# EAGLE schematic Calunium_v2_smd_1 (EAGLE 6.4)
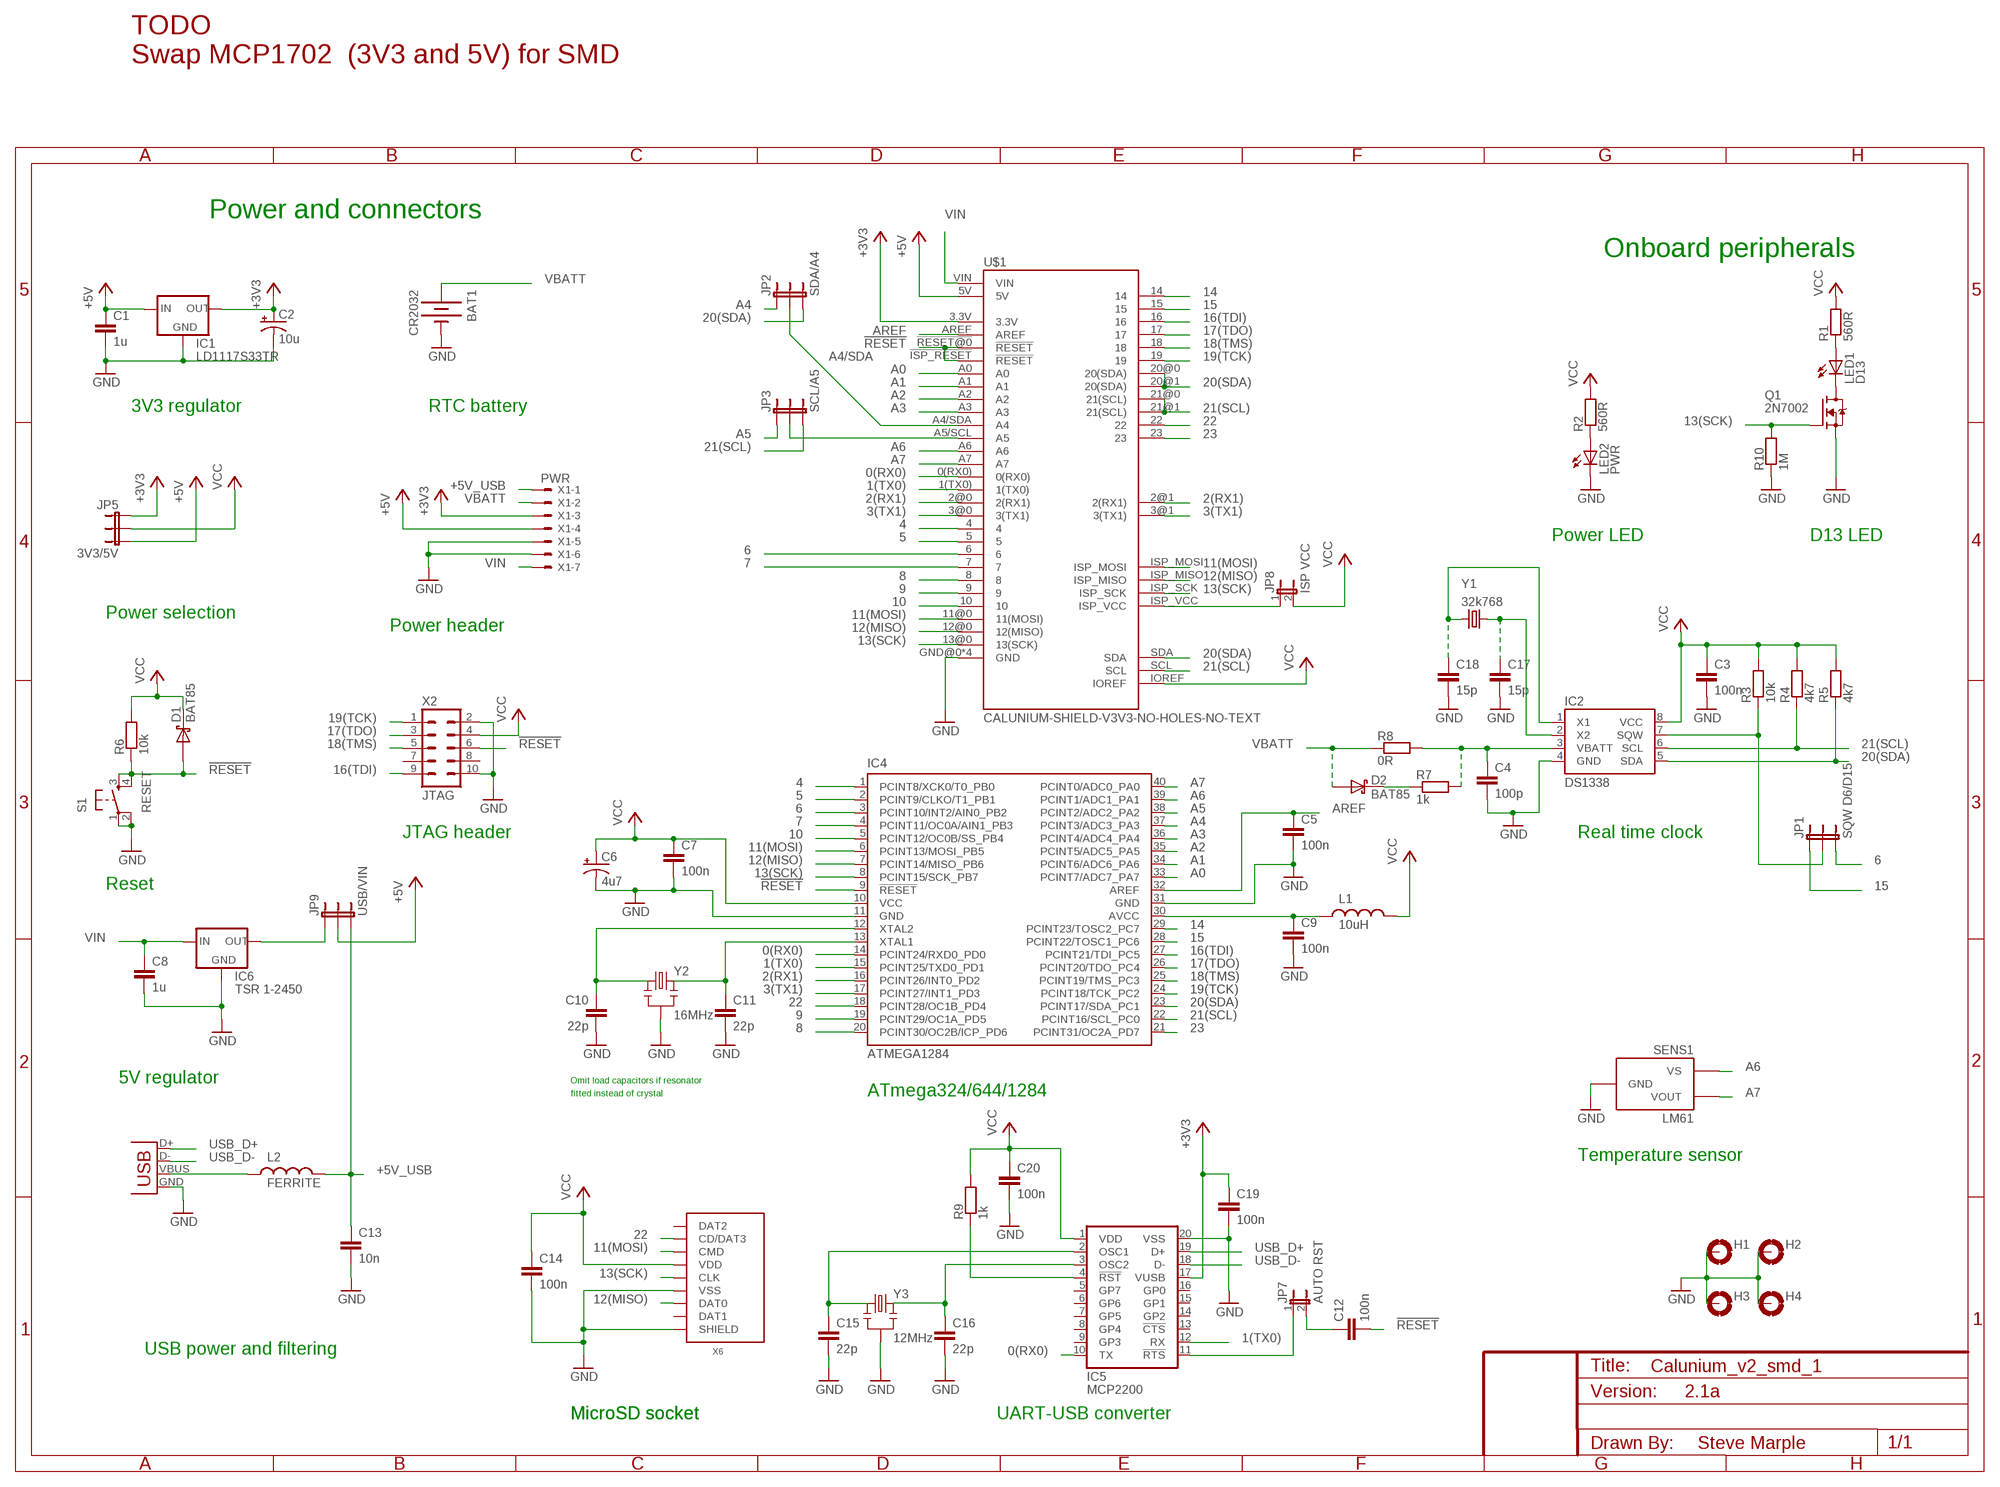
[diagram p0: schematic, sheet 1]

## Parts
BAT1  CR2032  BATTERY20PTH  [BATTCOM_20MM_PTH]
C1  1u  C-EU1206-HAND  [1206-HAND]
C2  10u  CAP_POLPTH2  [CPOL-RADIAL-10UF-25V]
C3  100n  C-EU1206-HAND  [1206-HAND]
C4  100p  C-EU1206-HAND  [1206-HAND]
C5  100n  C-EU1206-HAND  [1206-HAND]
C6  4u7  CAP_POLPTH2  [CPOL-RADIAL-10UF-25V]
C7  100n  C-EU1206-HAND  [1206-HAND]
C8  1u  C-EU1206-HAND  [1206-HAND]
C9  100n  C-EU1206-HAND  [1206-HAND]
C10  22p  C-EU0805-HAND  [0805-HAND]
C11  22p  C-EU0805-HAND  [0805-HAND]
C12  100n  C-EU1206-HAND  [1206-HAND]
C13  10n  C-EU1206-HAND  [1206-HAND]
C14  100n  C-EU1206-HAND  [1206-HAND]
C15  22p  C-EU0805-HAND  [0805-HAND]
C16  22p  C-EU0805-HAND  [0805-HAND]
C17  15p  C-EU0805-HAND  [0805-HAND]
C18  15p  C-EU0805-HAND  [0805-HAND]
C19  100n  C-EU1206-HAND  [1206-HAND]
C20  100n  C-EU1206-HAND  [1206-HAND]
D1  BAT85  DIODE-SCHOTTKYSOT23-1-3-HAND  [SOT23-3-HAND]
D2  BAT85  DIODE-SCHOTTKYSOT23-1-3-HAND  [SOT23-3-HAND]
H1  MOUNT-PAD-ROUND3.0  [3,0-PAD]
H2  MOUNT-PAD-ROUND3.0  [3,0-PAD]
H3  MOUNT-PAD-ROUND3.0  [3,0-PAD]
H4  MOUNT-PAD-ROUND3.0  [3,0-PAD]
IC1  LD1117S33TR  V_REG_LD1117VXXSOT223-HAND  [SOT223-HAND]
IC2  DS1338  DS1307SO08  [SO08]
IC4  ATMEGA1284  ATMEGA644-20PU  [DIL40]
IC5  MCP2200  [SO20]
IC6  TSR 1-2450  V_REG_78XXTSR-1-XXXX  [TSR-1-XXXX]
JP1  SQW D6/D15  JUMPER-3PTH  [1X03]
JP2  SDA/A4  JUMPER-3PTH  [1X03]
JP3  SCL/A5  JUMPER-3PTH  [1X03]
JP5  3V3/5V  JUMPER-3PTH  [1X03]
JP7  AUTO RST  JUMPER-2PTH  [1X02]
JP8  ISP VCC  JUMPER-2PTH  [1X02]
JP9  USB/VIN  JUMPER-3PTH  [1X03]
L1  10uH  INDUCTOR1210-HAND  [1210-HAND]
L2  FERRITE  INDUCTOR0805-HAND  [0805-HAND]
LED1  D13  LED3MM  [LED3MM]
LED2  PWR  LED3MM  [LED3MM]
Q1  2N7002  [SOT23-3-ROTATED]
R1  560R  RESISTOR1206-HAND  [1206-HAND]
R2  560R  RESISTOR1206-HAND  [1206-HAND]
R3  10k  RESISTOR1206-HAND  [1206-HAND]
R4  4k7  RESISTOR1206-HAND  [1206-HAND]
R5  4k7  RESISTOR1206-HAND  [1206-HAND]
R6  10k  RESISTOR1206-HAND  [1206-HAND]
R7  1k  RESISTOR1206-HAND  [1206-HAND]
R8  0R  RESISTOR1206-HAND  [1206-HAND]
R9  1k  RESISTOR1206-HAND  [1206-HAND]
R10  1M  RESISTOR1206-HAND  [1206-HAND]
S1  RESET  TAC_SWITCHPTH  [TACTILE-PTH]
SENS1  LM61  [TO-92]
U$1  CALUNIUM-SHIELD-V3V3-NO-HOLES-NO-TEXT  [CALUNIUM-SHIELD-NO-OUTLINE-NO-HOLES-NO-TEXT-V3]
X1  PWR  22-23-2071  [22-23-2071]
X2  JTAG  ATMEL-JTAG  [CON-HARTING-ML10]
X3  USB  USBPTH  [USB-B-PTH]
X6  MICRO-SD-SOCKETHIROSE-DM3D  [MICRO-SD-SOCKET-HIROSE-DM3D]
Y1  32k768  CRYSTALTC38H  [TC38H]
Y2  16MHz  CRYSTAL-RESONATOR  [HC49U-V-RESONATOR]
Y3  12MHz  CRYSTAL-RESONATOR  [HC49U-V-RESONATOR]

## Nets
0(RX0): IC4.14(PCINT24/RXD0_PD0) IC5.10(TX) U$1.0(RX0)
1(TX0): IC4.15(PCINT25/TXD0_PD1) IC5.12(RX) U$1.1(TX0)
2(RX1): IC4.16(PCINT26/INT0_PD2) U$1.2@0(2(RX1)) U$1.2@1(2(RX1))
3(TX1): IC4.17(PCINT27/INT1_PD3) U$1.3@0(3(TX1)) U$1.3@1(3(TX1))
4: IC4.1(PCINT8/XCK0/T0_PB0) U$1.4
5: IC4.2(PCINT9/CLKO/T1_PB1) U$1.5
6: IC4.3(PCINT10/INT2/AIN0_PB2) JP1.3 U$1.6
7: IC4.4(PCINT11/OC0A/AIN1_PB3) U$1.7
8: IC4.20(PCINT30/OC2B/ICP_PD6) U$1.8
9: IC4.19(PCINT29/OC1A_PD5) U$1.9
10: IC4.5(PCINT12/OC0B/SS_PB4) U$1.10
11(MOSI): IC4.6(PCINT13/MOSI_PB5) U$1.11@0(11(MOSI)) U$1.ISP_MOSI X6.CMD
12(MISO): IC4.7(PCINT14/MISO_PB6) U$1.12@0(12(MISO)) U$1.ISP_MISO X6.DAT0
13(SCK): IC4.8(PCINT15/SCK_PB7) Q1.1(G) R10.2 U$1.13@0(13(SCK)) U$1.ISP_SCK X6.CLK
14: IC4.29(PCINT23/TOSC2_PC7) U$1.14
15: IC4.28(PCINT22/TOSC1_PC6) JP1.1 U$1.15
16(TDI): IC4.27(PCINT21/TDI_PC5) U$1.16 X2.9(TDI)
17(TDO): IC4.26(PCINT20/TDO_PC4) U$1.17 X2.3(TDO)
18(TMS): IC4.25(PCINT19/TMS_PC3) U$1.18 X2.5(TMS)
19(TCK): IC4.24(PCINT18/TCK_PC2) U$1.19 X2.1(TCK)
20(SDA): IC2.5(SDA) IC4.23(PCINT17/SDA_PC1) JP2.3 R5.1 U$1.20@0(20(SDA)) U$1.20@1(20(SDA)) U$1.SDA
21(SCL): IC2.6(SCL) IC4.22(PCINT16/SCL_PC0) JP3.3 R4.1 U$1.21@0(21(SCL)) U$1.21@1(21(SCL)) U$1.SCL
22: IC4.18(PCINT28/OC1B_PD4) U$1.22 X6.CD/DAT3
23: IC4.21(PCINT31/OC2A_PD7) U$1.23
!MCP2200_RESET: IC5.4(!RST) R9.1
!RESET: C12.2 D1.1(A) IC4.9(!RESET) R6.1 S1.3 S1.4 U$1.!ISP_RESET(!RESET) U$1.!RESET@0(!RESET) X2.6(!SRST)
+3V3 [power]: C2.1(+) C19.1 IC1.2(OUT) IC1.4(OUT) IC5.17(VUSB) JP5.1 U$1.3.3V X1.3
+5V [power]: C1.1 IC1.3(IN) JP5.3 JP9.2 U$1.5V X1.4
+5V_USB [power]: C13.1 JP9.3 L2.2 X1.1
A0: IC4.33(PCINT7/ADC7_PA7) U$1.A0
A1: IC4.34(PCINT6/ADC6_PA6) U$1.A1
A2: IC4.35(PCINT5/ADC5_PA5) U$1.A2
A3: IC4.36(PCINT4/ADC4_PA4) U$1.A3
A4: IC4.37(PCINT3/ADC3_PA3) JP2.1
A4/SDA: JP2.2 U$1.A4/SDA(A4)
A5: IC4.38(PCINT2/ADC2_PA2) JP3.1
A5/SCL: JP3.2 U$1.A5/SCL(A5)
A6: IC4.39(PCINT1/ADC1_PA1) SENS1.1(VS) U$1.A6
A7: IC4.40(PCINT0/ADC0_PA0) SENS1.2(VOUT) U$1.A7
AREF: C5.1 IC4.32(AREF) U$1.AREF
AUTO_RESET: IC5.11(!RTS) JP7.1
AVCC [power]: C9.1 IC4.30(AVCC) L1.1
GND [power]: BAT1.2(-) C1.2 C2.2(-) C3.2 C4.2 C5.2 C6.2(-) C7.2 C8.2 C9.2 C10.2 C11.2 C13.2 C14.2 C15.2 C16.2 C17.2 C18.2 C19.2 C20.2 H1.B3,0(MOUNT) H2.B3,0(MOUNT) H3.B3,0(MOUNT) H4.B3,0(MOUNT) IC1.1(GND) IC2.4(GND) IC4.11(GND) IC4.31(GND) IC5.20(VSS) IC6.GND LED2.K(C) Q1.2(S) R10.1 S1.1 S1.2 SENS1.3(GND) U$1.GND@0(GND) U$1.GND@1(GND) U$1.GND@2(GND) U$1.GND@3(GND) X1.5 X1.6 X2.2(GND) X2.10(GND) X3.GND X6.GND(VSS) X6.SHIELD@0(SHIELD) Y2.GND Y3.GND
N$1: C11.1 IC4.13(XTAL1) Y2.2
N$2: C10.1 IC4.12(XTAL2) Y2.1
N$3: LED1.A R1.1
N$4: LED1.K(C) Q1.3(D)
N$5: C18.1 IC2.1(X1) Y1.2
N$6 [power]: JP8.1 U$1.ISP_VCC
N$7: C16.1 IC5.3(OSC2) Y3.2
N$8: LED2.A R2.1
N$9: D2.3(C) R7.1
N$11: C4.1 IC2.3(VBATT) R7.2 R8.2
N$12: C17.1 IC2.2(X2) Y1.1
N$14: IC6.OUT JP9.1
N$15: C12.1 JP7.2
N$16 [power]: L2.1 X3.VBUS
N$18: C15.1 IC5.2(OSC1) Y3.1
SQW: IC2.7(SQW) JP1.2 R3.1
USB_D+: IC5.19(D+) X3.D+
USB_D-: IC5.18(D-) X3.D-
VBATT: BAT1.1(+) D2.1(A) R8.1 X1.2
VCC [power]: C3.1 C6.1(+) C7.1 C14.1 C20.1 D1.3(C) IC2.8(VCC) IC4.10(VCC) IC5.1(VDD) JP5.2 JP8.2 L1.2 R1.2 R2.2 R3.2 R4.2 R5.2 R6.2 R9.2 U$1.IOREF X2.4(VTREF) X6.VDD
VIN [power]: C8.1 IC6.IN U$1.VIN X1.7
Unconnected: IC5.5(GP7) IC5.6(GP6) IC5.7(GP5) IC5.8(GP4) IC5.9(GP3) IC5.13(!CTS) IC5.14(GP2) IC5.15(GP1) IC5.16(GP0) X2.7(NC) X2.8(NC) X6.DAT1 X6.DAT2

## Notes on the sheet
- TODO
  Swap MCP1702  (3V3 and 5V) for SMD
- Power and connectors
- Onboard peripherals
- 3V3 regulator | RTC battery
- Power LED | D13 LED
- Power selection
- Power header
- JTAG header | Real time clock
- Reset
- 5V regulator | Omit load capacitors if resonator
- fitted instead of crystal | ATmega324/644/1284
- Temperature sensor
- USB power and filtering
- 2.1a
- MicroSD socket | MicroSD socket | UART-USB converter
- Steve Marple

## Library data of the parts
BAT1 = SparkFun:BATTERY: Battery Holders Various common sizes : AA, AAA, 20mm coin cell and 12mm coin cell.
C1 C3-C5 C7-C9 C12-C20 = SteveMarple:C-EU
C2 = SteveMarple:CAP_POL: Capacitor Polarized These are standard SMD and PTH capacitors. Normally 10uF, 47uF, and 100uF in electrolytic and tantalum varieties. Always verify the external diameter of the through hole cap, it varies with capacity, voltage, and manufacturer. The EIA devices should be standard.
C6 = SparkFun:CAP_POL: Capacitor Polarized These are standard SMD and PTH capacitors. Normally 10uF, 47uF, and 100uF in electrolytic and tantalum varieties. Always verify the external diameter of the through hole cap, it varies with capacity, voltage, and manufacturer. The EIA devices should be standard.
C10 C11 = SteveMarple:C-EU; OPTION: Do not fit for ceramic resonator
D1 D2 = SteveMarple:DIODE-SCHOTTKY
H1-H4 = holes:MOUNT-PAD-ROUND: MOUNTING PAD, round
IC1 = SteveMarple:V_REG_LD1117VXX: CHECK PINOUT!!!!!!!!!!!!!!!!!!! LD1117VXX voltage regulator. We carry the 3.3V version (COM-00526) in TO-220 package.
IC2 = SteveMarple:DS1307
IC4 = SteveMarple:ATMEGA644-*PU: 8-bit Microcontroller with 64K Bytes In-System Programmable Flash Auto generated by make-symbol-device-package-bsdl.ulp Rev. 34 Source: http://www.atmel.com/dyn/resources/prod_documents/doc2593.pdf; MPN: ATMEGA644-20PU; OC_FARNELL: 1288340; OC_NEWARK: 23M5060
IC5 = SteveMarple:MCP2200: MCP2200 Microchip USB-UART interface.
IC6 = SteveMarple:V_REG_78XX: Voltage Regulator Standard 7805 5V regulator. IGO (Input Ground Output). Spark Fun Electronics SKU : COM-00107
JP1-JP3 JP5 JP9 = SparkFun:JUMPER-3
JP7 JP8 = SparkFun:JUMPER-2: Jumper Basic 0.1" spaced jumper. Use with breakaway headers.
L1 L2 = SteveMarple:INDUCTOR: Inductors Basic Inductor/Choke - 0603 and 1206. Footprints are not proven and vary greatly between part numbers.
LED1 LED2 = SparkFun:LED: LEDs Standard schematic elements and footprints for 5mm, 3mm, 1206, and 0603 sized LEDs. 5mm - Spark Fun Electronics SKU : COM-00529 (and others)
Q1 = SteveMarple:2N7002: N-CHANNEL ENHANCEMENT MODE FIELD EFFECT TRANSISTOR; MPN: 2N7002-7-F; OC_FARNELL: 1713823; OC_NEWARK: 25R5679; PACKAGE: SOT-23-3; SUPPLIER: DIODES INC.
R1-R10 = SteveMarple:RESISTOR: 1/4W PTH resistor
S1 = SparkFun:TAC_SWITCH: Momentary Switch Button commonly used for reset or general input. Spark Fun Electronics SKU : COM-00097
SENS1 = SteveMarple:LM61
U$1 = SteveMarple:CALUNIUM-SHIELD-V3
X1 = con-molex:22-23-2071: .100" (2.54mm) Center Header - 7 Pin; MF: MOLEX; MPN: 22-23-2071; OC_FARNELL: 1654534; OC_NEWARK: 56H0445
X2 = SteveMarple:ATMEL-JTAG: ATMEL JTAG header
X3 = SteveMarple:USB: USB Connectors USB-B-PTH is fully proven SKU : PRT-00139 USB-miniB is fully proven SKU : PRT-00587 USB-A-PCB is untested. USB-A-H is throughly reviewed, but untested. Spark Fun Electronics SKU : PRT-00437 USB-B-SMT is throughly reviewed, but untested. Needs silkscreen touching up. USB-A-S has not been used/tested USB-MB-H has not been used/tested
X6 = SteveMarple:MICRO-SD-SOCKET
Y1 = SteveMarple:CRYSTAL: Crystals Various standard crystals. Proven footprints. Spark Fun Electronics SKU : COM-00534
Y2 Y3 = SteveMarple:CRYSTAL-RESONATOR: Crystal/resonator; OPTION: Crystal or ceramic resonator. Max 12MHz for 3V3 operation.

## Net classes
1 power: width 0.381 mm
3 antenna: width 0.61 mm